# EAGLE design riffle-CTL-0.2 (EAGLE 7.2.0)
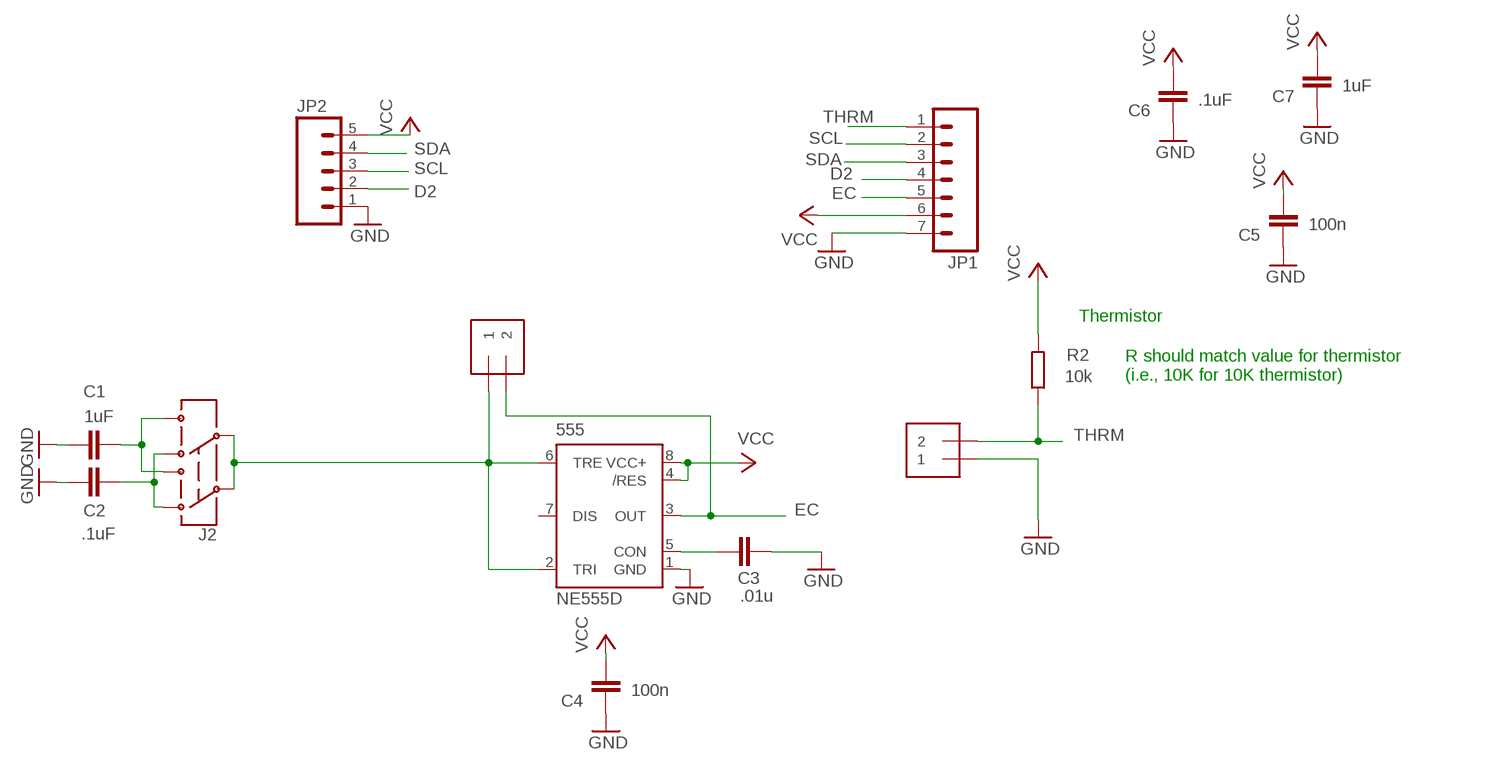
[diagram p0: schematic, sheet 1]

## Parts
555  NE555D  [SO08@1]
C1  1uF  C-EUC0805  [C0805]
C2  .1uF  C-EUC0805  [C0805]
C3  .01u  C-EUC0805  [C0805]
C4  100n  C-EUC0805  [C0805]
C5  100n  C-EUC0805  [C0805]
C6  .1uF  C-EUC0805  [C0805]
C7  1uF  C-EUC0805  [C0805]
EC  1X2-3.5MM  [1X2-3.5MM]
J2  AYZ0202  [AYZ0202]
JP1  M07  [1X07]
JP2  M05PTH  [1X05]
R2  10k  R-EU_R0805  [R0805]
THRM  1X2-3.5MM  [1X2-3.5MM]

## Nets
D2: JP1.4 JP2.2
EC: 555.3(OUT) EC.2 JP1.5
GND: 555.1(GND) C1.2 C2.2 C3.1 C4.1 C5.1 C6.1 C7.1 JP1.7 JP2.1 THRM.1
N1: 555.2(TRI) 555.6(TRE) EC.1 J2.2 J2.5
N$2: 555.5(CON) C3.2
N$6: C2.1 J2.3 J2.6
SCL: JP1.2 JP2.3
SDA: JP1.3 JP2.4
THRM: JP1.1 R2.1 THRM.2
VCC: 555.4(/RES) 555.8(VCC+) C4.2 C5.2 C6.2 C7.2 JP1.6 JP2.5 R2.2
VDD2: C1.1 J2.1 J2.4
Unconnected: 555.7(DIS)

## Notes on the sheet
- Thermistor
- R should match value for thermistor
  (i.e., 10K for 10K thermistor)

## Library data of the parts
555 = SparkFun-AnalogIC:NE555: General purpose bipolar Timer
C1-C7 = resistor:C-EU: CAPACITOR, European symbol
EC THRM = adafruit:1X2: 3.5mm Terminal block http://www.ladyada.net/library/pcb/eaglelibrary.html
J2 = SparkFunNew:AYZ0202: SPDT Slide Switch Simple SMD single-pull double-throw slide switch. Good for less than 350mA power switch, switching UARTs between devices, etc. Spark Fun Electronics SKU : COM-00597
JP1 = SparkFun-Connectors:M07: Header 7 Standard 7-pin 0.1" header. Use with straight break away headers (SKU : PRT-00116), right angle break away headers (PRT-00553), swiss pins (PRT-00743), machine pins (PRT-00117), and female headers (PRT-00115). NOTES ON THE VARIANTS LOCK and LOCK_LONGPADS... This footprint was designed to help hold the alignment of a through-hole component (i.e. 7-pin header) while soldering it into place. You may notice that each hole has been shifted either up or down by 0.005 of an inch from it's more standard position (which is usually a perfectly straight line). This slight alteration caused the pins (the squares in the middle) to touch the edges of the holes. Because they are alternating, it causes a "brace" to hold the header in place. 0.005 has proven to be the perfect amount of "off-center" position when using our standard breakaway headers. Although looks a little odd when you look at the bare footprint, once you have a header in there, the alteration is very hard to notice. Also, if you push a header all the way into place, it is covered up entirely on the bottom side. This idea of altering the position of holes to aid alignment will be further integrated into the Sparkfun Library for other footprints. It can help hold any component with 3 or more connection pins.
JP2 = SparkFun-Connectors:M05: Header 5 Standard 5-pin 0.1" header. Use with straight break away headers (SKU : PRT-00116), right angle break away headers (PRT-00553), swiss pins (PRT-00743), machine pins (PRT-00117), and female headers (PRT-00115). Molex polarized connector foot print use with SKU : PRT-08230 with associated crimp pins and housings.
R2 = rcl:R-EU_: RESISTOR, European symbol

## Net classes
0 default: width 0.203 mm, drill 0.33 mm, clearance 0.203 mm

## Board
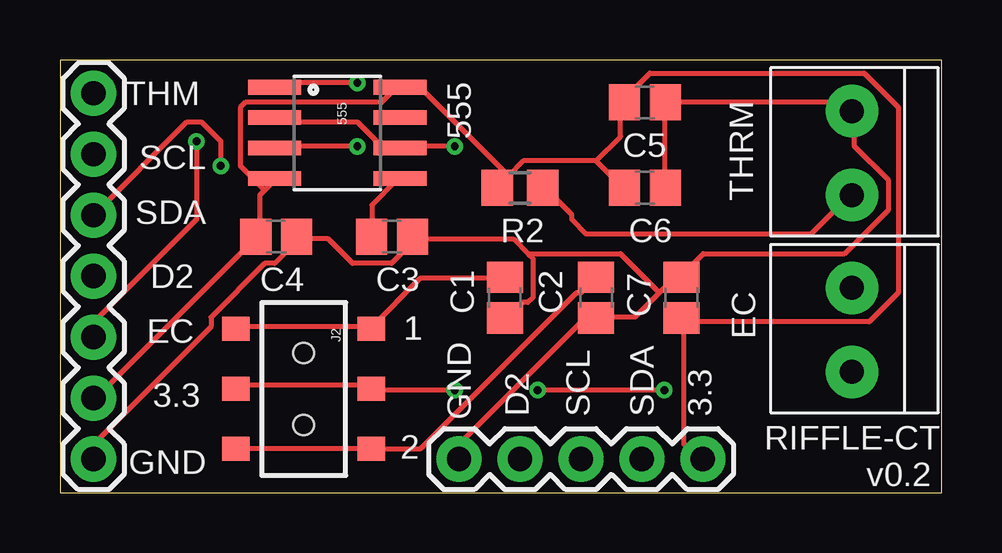
[diagram p1: board, top side]
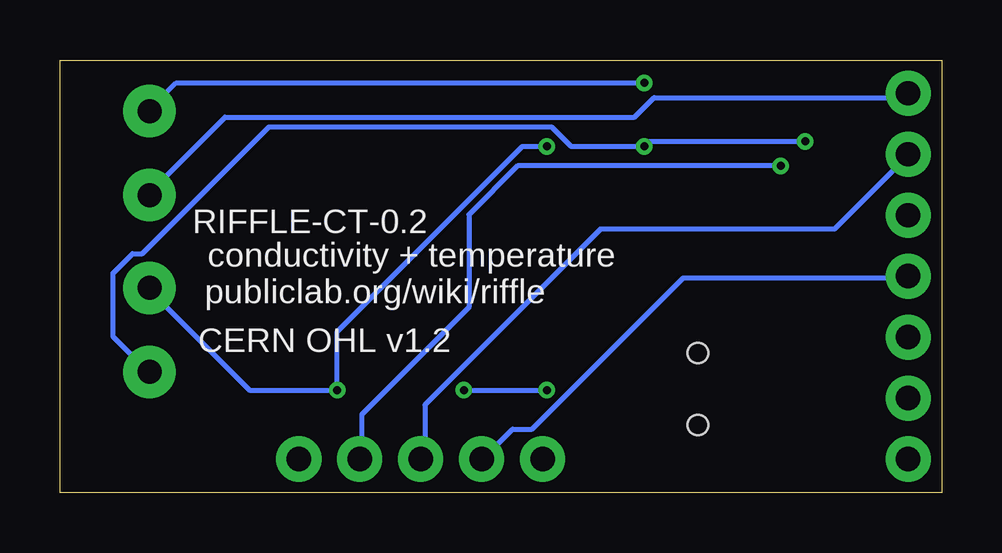
[diagram p2: board, bottom side, seen from below]

Size 36.75 x 18.02 mm. Coordinates in mm from the lower left corner, seen from the top.
Outline: 0,0 36.75,0 36.75,18.02 0,18.02 0,0
Copper layers (1*16): Top 0.0356mm / dielectric 1.5011mm / Bottom 0.0356mm
Design rules "LaenPCBOrder": minimum track width 6mil, minimum drill 13mil, track to track 6mil, track to pad 6mil, pad to pad 6mil, via to via 6mil, smd to smd 6mil, copper to edge 15mil, drill to drill 6mil, minimum pad ring 7mil, minimum via ring 7mil, stop-mask expansion 3mil, vias tented up to drill 0mil, thermal gap 10mil

### Footprints (pad centres in the part's own frame; a part is rotated, then mirrored left to right if it is on the bottom)
SO08@1 = smd 0.61 x 2.21: 1 -1.905,-2.616; 2 -0.635,-2.616; 3 0.635,-2.616; 4 1.905,-2.616; 5 1.905,2.616; 6 0.635,2.616; 7 -0.635,2.616; 8 -1.905,2.616
C0805 = smd 1.3 x 1.5: 1 -0.85,0; 2 0.85,0
1X2-3.5MM = drill 1 pad 2.184: 1 1.8,0; 2 -1.7,0
AYZ0202 = smd 1 x 1.15: 1 -2.5,2.825; 2 0,2.825; 3 2.5,2.825; 4 -2.5,-2.825; 5 0,-2.825; 6 2.5,-2.825 | hole 0.85: 1.5,0; -1.5,0
1X07 = drill 1.016 pad 1.88: 1 0,0; 2 2.54,0; 3 5.08,0; 4 7.62,0; 5 10.16,0; 6 12.7,0; 7 15.24,0
1X05 = drill 1.016 pad 1.88: 1 0,0; 2 2.54,0; 3 5.08,0; 4 7.62,0; 5 10.16,0
R0805 = smd 1.3 x 1.5: 1 -0.95,0; 2 0.95,0

### Placement (x,y rotation side)
555  11.56,14.99 270 top
C1  18.54,8.13 270 top
C2  22.35,8.13 270 top
C3  13.84,10.67 180 top
C4  9.02,10.67 180 top
C5  24.38,16.26 180 top
C6  24.38,12.7 180 top
C7  25.91,8.13 270 top
EC  33.02,6.73 90 top
J2  10.16,4.32 270 top
JP1  1.4,16.64 270 top
JP2  16.64,1.4 0 top
R2  19.18,12.7 180 top
THRM  33.02,14.1 90 top

### Tracks (layer width: path | path; a pad name or v marks a point on that pad's centre or on a via)
D2
  Bottom 0.203: JP1.4 1.42,8.94 10.77,8.94 17.07,2.64 17.88,2.64 19.1,1.42 JP2.2
EC  (via drill 0.33)
  Top 0.203: v12.39,14.43 8.94,14.43 555.3 | v5.69,14.63 5.69,11.38 1.42,7.11 1.42,6.5 JP1.5
  Bottom 0.203: EC.2 33.12,5.08 34.54,6.5 34.54,9.14 33.73,9.96 33.33,9.96 28.04,15.24 16.26,15.24 15.44,14.43 v12.39,14.43 12.19,14.63 v5.69,14.63
GND  (via drill 0.33)
  Top 0.203: C6.1 25.2,12.8 25.2,16.26 C5.1 32.72,16.26 32.92,16.05 THRM.1 33.12,15.85 33.12,14.43 34.54,13.01 34.54,11.79 32.72,9.96 26.82,9.96 26.01,9.14 C7.1 25.81,9.14 24.99,8.33 | 8.94,16.87 555.1 8.94,17.07 v12.39,17.07 | 24.99,8.33 23.98,7.32 22.35,7.32 C2.2 22.35,7.11 21.74,7.11 16.66,2.03 16.66,1.42 JP2.1 | 9.96,10.57 11.18,10.57 12.19,9.55 13.82,9.55 14.83,10.57 | 19.51,9.96 18.9,10.57 14.83,10.57 | 19.51,9.96 19.71,9.75 19.71,8.13 19.51,7.92 19.3,7.92 18.69,7.32 C1.2 | 14.83,10.57 C3.1 | 24.99,8.33 23.37,9.96 19.51,9.96 | 9.96,10.57 8.94,9.55 8.53,9.55 6.3,7.32 6.3,6.91 1.42,2.03 1.42,1.42 JP1.7 | 9.96,10.57 C4.1
  Bottom 0.203: v12.39,17.07 31.9,17.07 32.92,16.05 THRM.1
N1  (via drill 0.33)
  Top 0.203: 555.2 8.94,15.44 12.39,15.44 13.41,14.43 14.02,14.43 555.6 14.22,14.43 v16.46,14.43 | J2.5 7.52,4.47 12.8,4.47 J2.2 13.01,4.27 v16.46,4.27 | v25.2,4.27 v19.91,4.27
  Bottom 0.203: v19.91,4.27 v16.46,4.27 | EC.1 32.92,8.33 28.85,4.27 v25.2,4.27 25.2,6.71 17.48,14.43 v16.46,14.43
N$2
  Top 0.203: C3.2 13.01,10.77 13.01,11.99 14.02,13.01 555.5
N$6
  Top 0.203: J2.6 7.52,1.83 12.8,1.83 J2.3 13.01,1.83 15.04,1.83 21.54,8.33 21.74,8.33 22.35,8.94 C2.1
SCL
  Bottom 0.203: JP2.3 21.54,1.42 21.54,3.66 14.22,10.97 4.47,10.97 1.42,14.02 JP1.2
SDA  (via drill 0.33)
  Top 0.203: v6.71,13.61 6.71,14.63 5.89,15.44 5.28,15.44 JP1.3
  Bottom 0.203: v6.71,13.61 17.68,13.61 19.71,11.58 19.71,7.72 24.18,3.25 24.18,1.42 JP2.4
THRM
  Top 0.203: R2.1 20.32,12.6 21.34,11.58 21.34,11.38 21.95,10.77 31.29,10.77 32.92,12.39 THRM.2
  Bottom 0.203: JP1.1 1.42,16.46 11.99,16.46 12.8,15.65 29.87,15.65 32.92,12.6 THRM.2
VCC
  Top 0.203: 8.53,12.6 8.94,13.01 555.4 | 8.53,12.6 8.33,12.39 8.33,10.77 C4.2 8.13,10.57 1.42,3.86 JP1.6 | 26.01,7.11 26.01,2.03 26.62,1.42 JP2.5 | 18.69,13.21 19.3,13.82 22.35,13.82 | 18.69,13.21 18.29,12.8 R2.2 18.69,13.21 | 22.35,13.82 23.37,12.8 C6.2 | 23.37,16.26 23.37,14.83 22.35,13.82 | 18.69,13.21 15.04,16.87 14.22,16.87 555.8 14.02,16.87 13.41,16.26 7.72,16.26 7.52,16.05 7.52,13.61 8.53,12.6 | 26.01,7.11 33.73,7.11 34.95,8.33 34.95,16.05 33.53,17.48 24.59,17.48 23.37,16.26 | 26.01,7.11 C7.2 | 23.37,16.26 C5.2
VDD2
  Top 0.203: J2.4 7.52,6.91 12.8,6.91 J2.1 13.01,6.91 15.04,8.94 18.49,8.94 C1.1

### Text on the board
tPlace: THM | 555 | SCL | SDA | D2 | EC | 1 | 3.3 | GND | D2 | SCL | SDA | 3.3 | RIFFLE-CT | GND | 2 | v0.2
bPlace: RIFFLE-CT-0.2 | conductivity + temperature | publiclab.org/wiki/riffle | CERN OHL v1.2